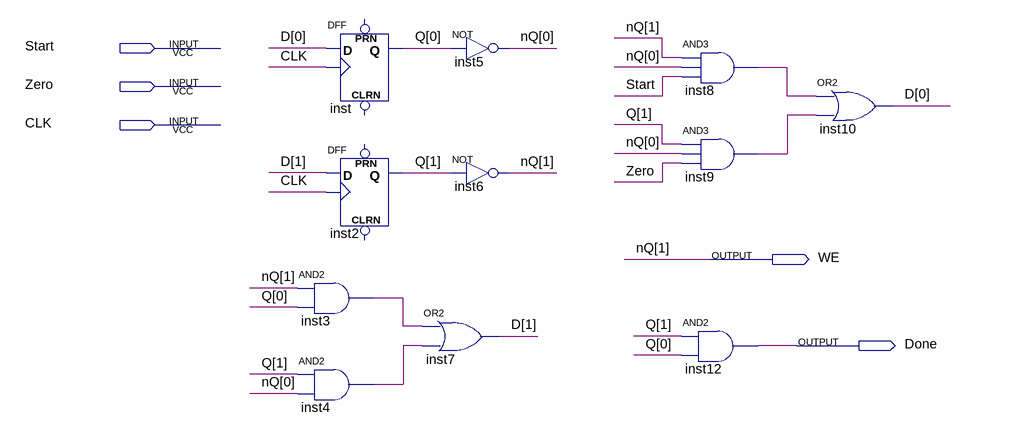
[diagram p0: schematic sheet]
// Quartus schematic Control.bdf as structural Verilog: 11 symbols, 5 pins
module Control (
  input  Start,
  input  Zero,
  input  CLK,
  output WE,
  output Done
);

  wire inst3_out, inst4_out, inst8_out, inst9_out;
  wire [0:0] nQ;
  wire [1:0] D, Q;

  and inst3 (inst3_out, WE, Q[0]);
  and inst4 (inst4_out, Q[1], nQ[0]);
  DFF inst (.CLK(CLK), .D(D[0]), .Q(Q[0]));  // open: CLRN, PRN
  DFF inst2 (.CLK(CLK), .D(D[1]), .Q(Q[1]));  // open: CLRN, PRN
  not inst5 (nQ[0], Q[0]);
  not inst6 (WE, Q[1]);
  or inst7 (D[1], inst3_out, inst4_out);
  and inst8 (inst8_out, WE, nQ[0], Start);
  and inst9 (inst9_out, Q[1], nQ[0], Zero);
  and inst12 (Done, Q[1], Q[0]);
  or inst10 (D[0], inst8_out, inst9_out);

  // Other names for the same wires on the sheet: nQ[1] = WE
endmodule
